# EasyEDA Pro project 3.PCB工程源文件-WCH-DAPLink x RY-CH32V203.epro

# Schematic schematic1
Create Date: 2024-02-26; Page Name: P1; Project Name: wch-daplink V1.0; Schematic Name: schematic1; Update Date: 2024-03-10; Company: 嘉立创EDA; Page Size: A4; Version: V2.0
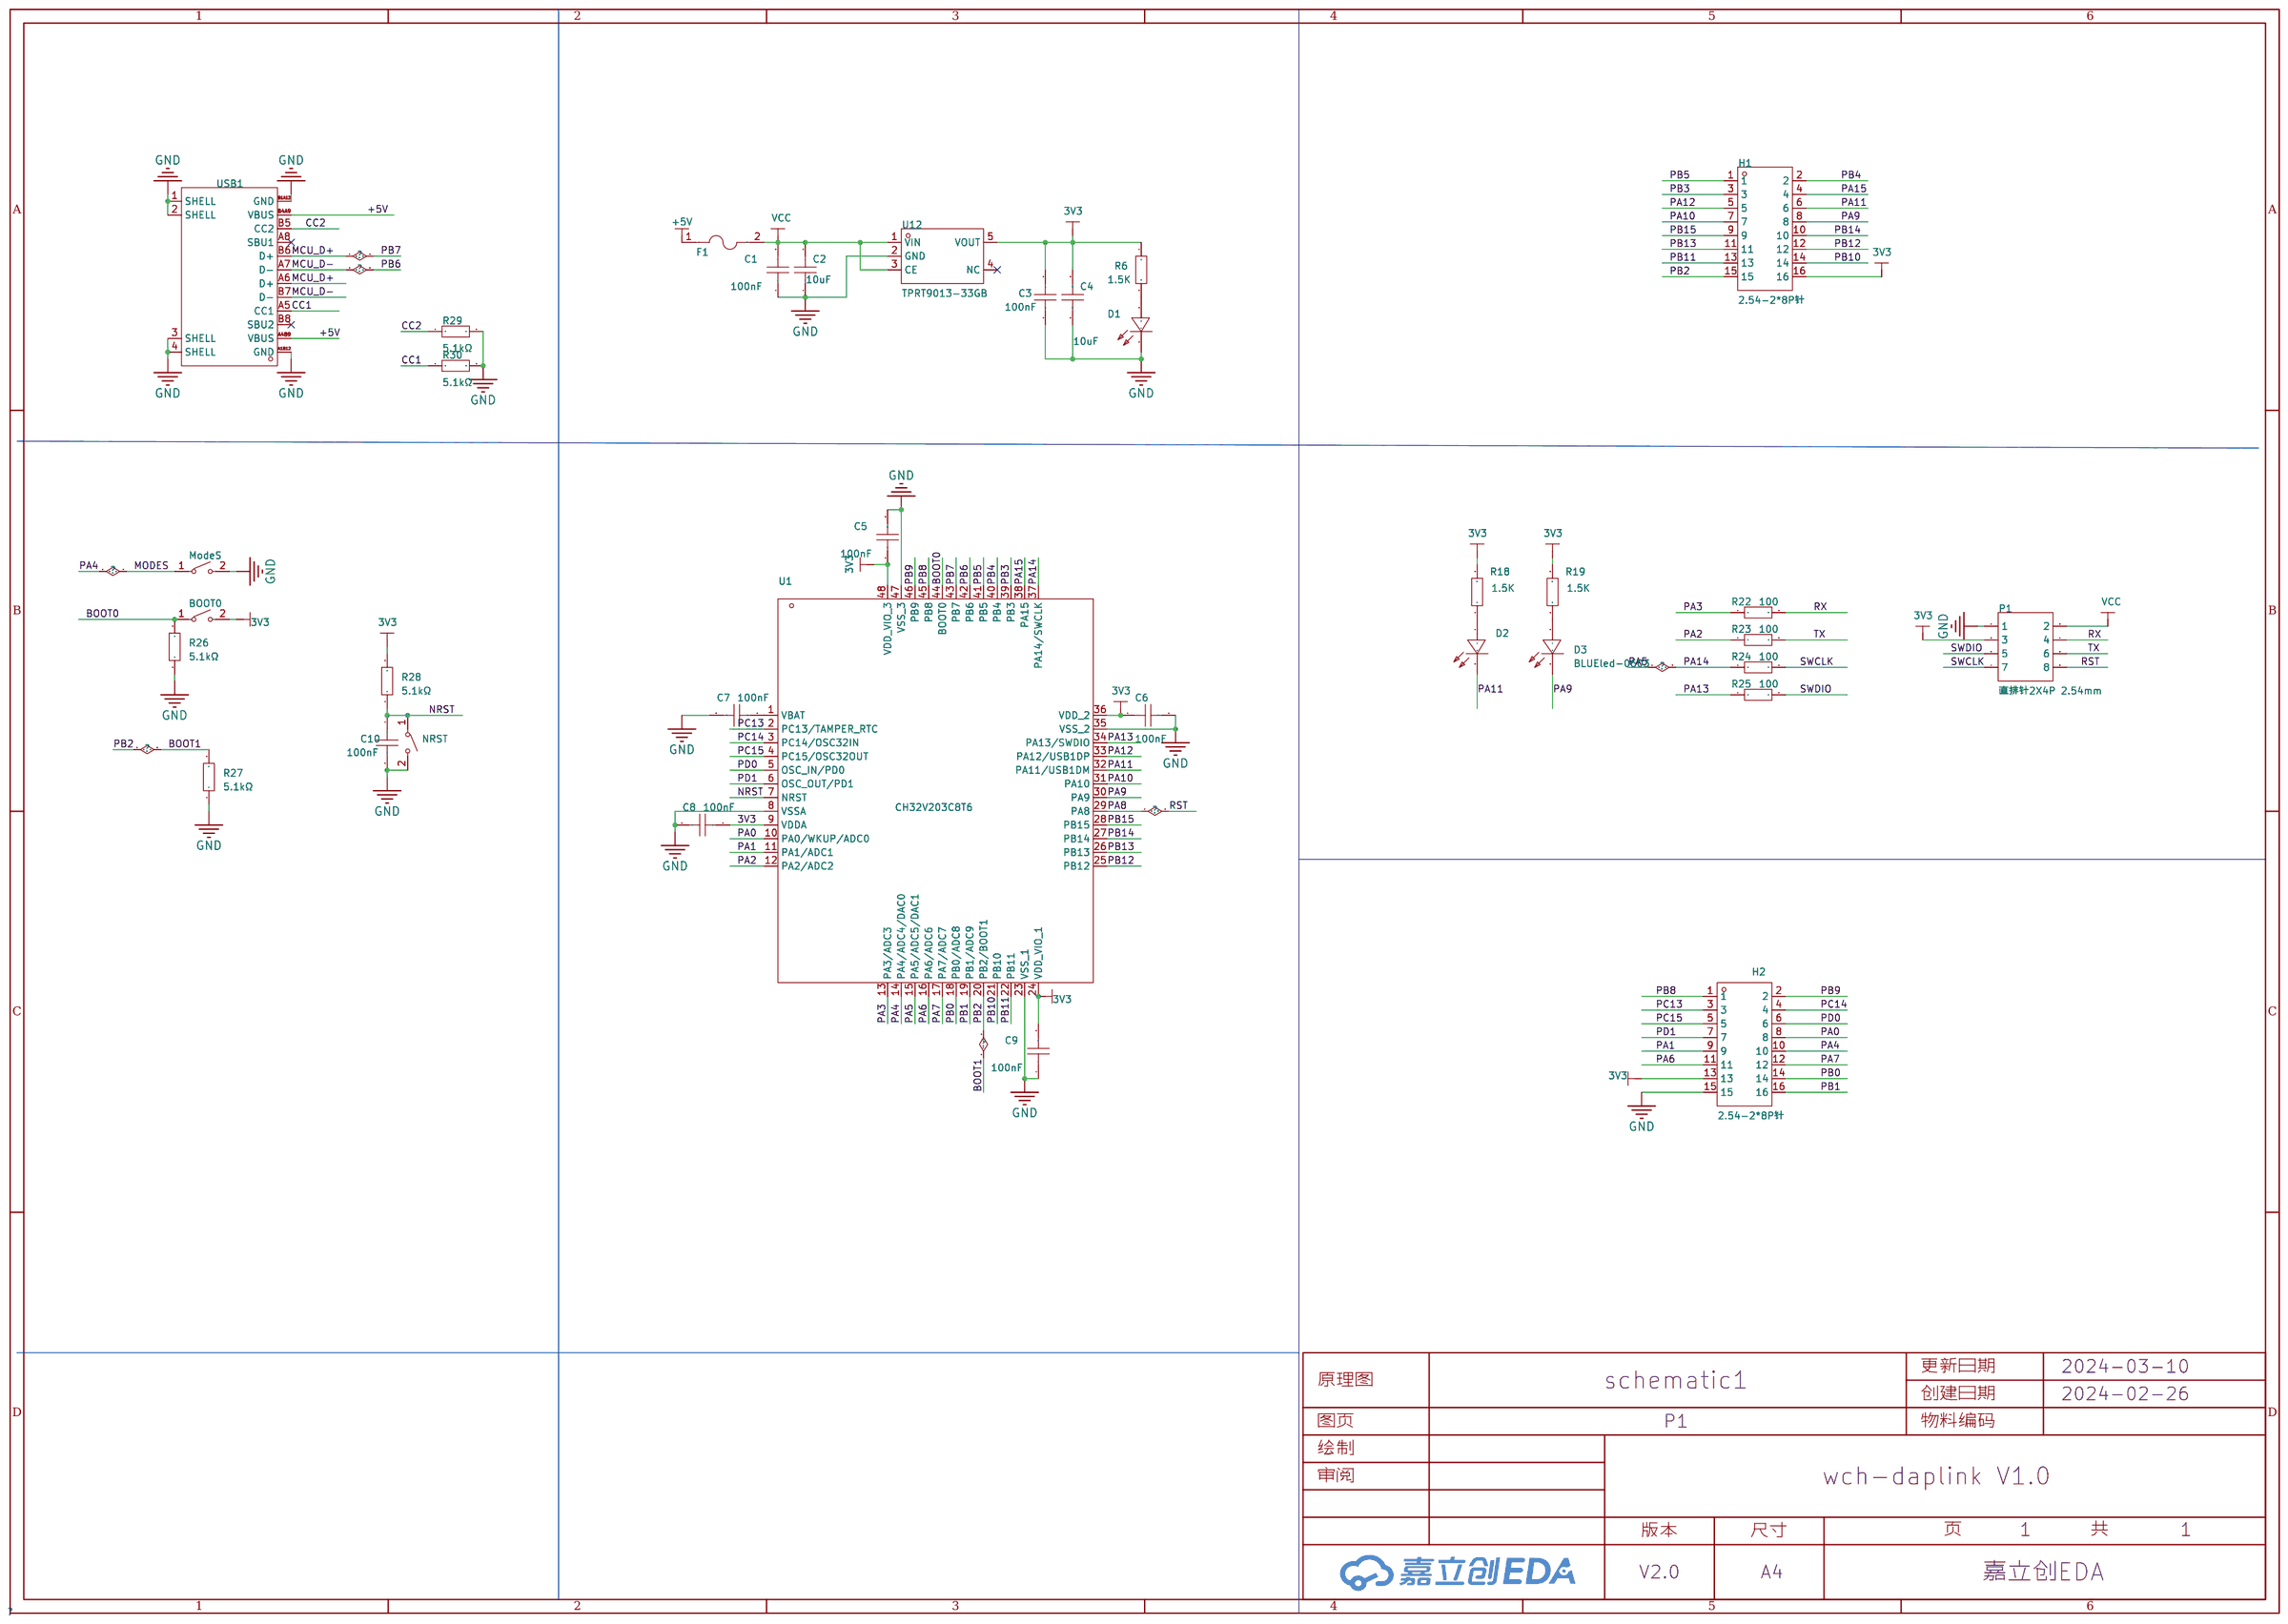
[diagram p0: schematic sheet]

## Parts
BOOT0  TS-1088R-02526  [SW-SMD_L3.9-W3.0-P4.45]
C1  100nF  [c0603]
C2  10uF  [c0805]
C3  100nF  [c0603]
C4  10uF  [c0805]
C5  100nF  [c0603]
C6  100nF  [c0603]
C7  100nF  [c0603]
C8  100nF  [c0603]
C9  100nF  [c0603]
C10  100nF  [c0603]
D1  NCD0603R3  [led0603-r-rd_red]
D2  NCD0603R3  [LED0603-R-RD_RED]
D3  BLUEled-0603  [LED0603-RD_BLUE]
F1  -  [F0805]
H1  2.54-2*8P针  [HDR-TH_16P-P2.54-V-M-R2-C8-S2.54]
H2  2.54-2*8P针  [HDR-TH_16P-P2.54-V-M-R2-C8-S2.54]
ModeS  TS-1088R-02526  [SW-SMD_L3.9-W3.0-P4.45]
NRST  TS-1088R-02526  [SW-SMD_L3.9-W3.0-P4.45]
P1  直排针2X4P 2.54mm  [HDR-TH_8P-P2.54-V-M-R2-C4-S2.54]
R6  1.5K  [R0603]
R18  1.5K  [R0603]
R19  1.5K  [R0603]
R22  100  [R0603]
R23  100  [R0603]
R24  100  [R0603]
R25  100  [R0603]
R26  5.1kΩ  [R0603]
R27  5.1kΩ  [R0603]
R28  5.1kΩ  [R0603]
R29  5.1kΩ  [R0603]
R30  5.1kΩ  [R0603]
U1  CH32V203C8T6  [LQFP-48_L7.0-W7.0-P0.50-LS9.0-BL]
U12  TPRT9013-33GB  [SOT-23-5_L3.0-W1.7-P0.95-LS2.8-BL]
USB1  -  [USB-C-SMD_G-SWITCH_GT-USB-7010EN]

## Library data of the parts
BOOT0 ModeS NRST = TS-1088R-02526: 触点电流:50mA;额定电压(DC):12V;电路结构:单刀单掷;安装方式:立贴;按钮形状:圆形按钮;带灯:-;开关长度:3.9mm;开关宽度:2.93mm;开关高度:2.5mm;; LCSC Part Name: 贴片无柱小龟轻触开关 260GF; Supplier Part: C455281; Manufacturer: XUNPU(讯普); Supplier Footprint: SMD,3x4x2.5mm; JLCPCB Part Class: Extended Part; Datasheet: https://atta.szlcsc.com/upload/public/pdf/source/20191118/C455281_EC5379764BC1462550DF64BBBFEA9579.pdf; Supplier: LCSC; Contact Current: 50mA; Voltage Rating (DC): 12V; Circuit: 单刀单掷; Mounting Style: 立贴; Actuator Style: 圆形按钮; Switch Length: 3.9mm; Switch Width: 2.93mm; Switch Height: 2.5mm
C1 C3 C5-C10 = CC0603KRX7R9BB104: 容值:100nF;精度:±10%;额定电压:50V;材质(温度系数):X7R;; LCSC Part Name: 100nF ±10% 50V; Supplier Part: C14663; Manufacturer: YAGEO(国巨); Supplier Footprint: 0603; JLCPCB Part Class: Basic Part; Datasheet: https://atta.szlcsc.com/upload/public/pdf/source/20170116/1484561234239.pdf; Supplier: LCSC; Tolerance: ±10%; Voltage Rated: 50V; Temperature Coefficient: X7R
C2 C4 = CC0805FRNPO9BN330: 容值:33pF;精度:±1pF;额定电压:50V;材质(温度系数):NP0;; LCSC Part Name: 33pF ±1pF 50V; Supplier Part: C541516; Manufacturer: YAGEO(国巨); Supplier Footprint: 0805; JLCPCB Part Class: Extended Part; Datasheet: https://atta.szlcsc.com/upload/public/pdf/source/20200615/C541516_87B4F5CEA473EFDDBB2B4786DAFFF3AA.pdf; Supplier: LCSC; Tolerance: ±1pF; Voltage Rated: 50V; Temperature Coefficient: NP0
D1 D2 = NCD0603R3: 尺寸1.6x0.8x0.8；IF=20ma：1.6~2.6v，620~640nm,51~150mcd金线，光强高，功耗低，可靠性好，寿命长; LCSC Part Name: 红色;贴片LED;0603红灯;; Supplier Part: C3151730; Manufacturer: 国星光电; Supplier Footprint: 0603; JLCPCB Part Class: Extended Part; Datasheet: https://atta.szlcsc.com/upload/public/pdf/source/20220704/CBFF28C1847A97213A75929E60B7DDE7.pdf; Supplier: LCSC
D3 = BLUEled-0603: Supplier Part: C9900004683; Supplier Footprint: LED0603; JLCPCB Part Class: 扩展库; Supplier: LCSC
F1 = ASMD0805-075: 最大电压:6V;最大电流:40A;保持电流:750mA;跳闸电流:1.5A;消耗功率:600mW;初始态阻值(最小值):90mΩ;跳断后阻值(最大值):385mΩ;最大动作时间:200ms;工作温度:-40~+85;; LCSC Part Name: 0.75A 自恢复; Supplier Part: C135330; Manufacturer: JDTfuse集电通; Supplier Footprint: 0805; JLCPCB Part Class: Extended Part; Datasheet: https://atta.szlcsc.com/upload/public/pdf/source/20171014/C135330_15079756464341038401.pdf; Supplier: LCSC; Operating Voltage (Max): 6V; Current Rating (Max): 40A; Hold Current: 750mA; Trip Current: 1.5A; Power Dissipation: 600mW; Resistance - Initial (Ri) (Min): 90mΩ; Resistance - Post Trip (R1) (Max): 385mΩ; Maximum Time to Trip: 200ms; Operating Temperature: -40~+85
H1 H2 = 2.54-2*8P针_C779499: 圆针/方针:-;额定电流:-;额定电压:-;配合针长度:-;塑高:-;触头材质:-;; LCSC Part Name: 双排直插 2*8排针 2.54mm; Supplier Part: C779499; Manufacturer: BOOMELE(博穆精密); Supplier Footprint: 插件,P=2.54mm; JLCPCB Part Class: 扩展库; Datasheet: https://atta.szlcsc.com/upload/public/pdf/source/20221201/C605E3BE9C0F7226363017EFD1BDE852.pdf; Supplier: LCSC
P1 = 直排针2X4P 2.54mm: 圆针/方针:-;额定电流:-;额定电压:-;配合针长度:-;塑高:-;触头材质:-;; LCSC Part Name: 排针 2*4P 2.54mm; Supplier Part: C58363; Manufacturer: BOOMELE(博穆精密); Supplier Footprint: 插件,P=2.54mm; JLCPCB Part Class: 扩展库; Datasheet: https://atta.szlcsc.com/upload/public/pdf/source/20151026/1457707506726.pdf; Supplier: LCSC
R6 R18 R19 R22-R25 = TR0603B10K0P0525Z: 电阻类型:薄膜电阻;阻值:10kΩ;精度:±0.1%;功率:100mW;温度系数:±25ppm/;最大工作电压:75V;工作温度范围:-55~+155;; LCSC Part Name: 10kΩ ±0.1% 100mW; Supplier Part: C188363; Manufacturer: EVER OHMS(天二科技); Supplier Footprint: 0603; JLCPCB Part Class: Extended Part; Datasheet: https://atta.szlcsc.com/upload/public/pdf/source/20190415/C188363_433BF05B6FB8F7A0F5F35A3E4390C55A.pdf; Supplier: LCSC; Type: 薄膜电阻; Tolerance: ±0.1%; Power(Watts): 100mW; Temperature Coefficient: ±25ppm/; Overload Voltage (Max): 75V; Operating Temperature Range: -55~+155
R26-R30 = 0603WAF5101T5E: 阻值:5.1kΩ;精度:±1%;功率:100mW;温度系数:±100ppm/℃;电阻类型:厚膜电阻;; LCSC Part Name: 5.1kΩ ±1% 100mW 厚膜电阻; Supplier Part: C23186; Manufacturer: UNI-ROYAL(厚声); Supplier Footprint: 0603; JLCPCB Part Class: Basic Part; Datasheet: https://atta.szlcsc.com/upload/public/pdf/source/20200306/C422600_1E6D84923E4A46A82E41ADD87F860B5C.pdf; Supplier: LCSC; Tolerance: ±1%; Power(Watts): 100mW; Overload Voltage (Max): 75V; Temperature Coefficient: ±100ppm/℃; Type: 厚膜电阻; Operating Temperature Range: -55℃~+155℃
U1 = CH32V203C8T6: CPU内核:RISC-V;程序存储容量:64KB;RAM总容量:20KB;GPIO端口数量:-;工作电压范围:-;CPU最大主频:144MHz;程序存储器类型:FLASH;; Supplier Part: C3001172; Manufacturer: WCH(南京沁恒); Supplier Footprint: LQFP-48(7x7); JLCPCB Part Class: 扩展库; Datasheet: https://atta.szlcsc.com/upload/public/pdf/source/20220425/D3E728E801B9982E2758AC225E3A30F9.pdf; Supplier: LCSC; CPU Core: RISC-V; Program Storage Size: 64KB; RAM Size: 20KB; CPU Maximum Speed: 144MHz; Program Memory Type: FLASH
U12 = TPRT9013-33GB: 输出类型:-;; Supplier Part: C587158; Manufacturer: TECH PUBLIC(台舟); Supplier Footprint: SOT-23-5; JLCPCB Part Class: 扩展库; Datasheet: https://atta.szlcsc.com/upload/public/pdf/source/20210810/692D4D0C3CF190F9330EFD28C3E572CB.pdf; Supplier: LCSC
USB1 = HC-TYPE-C-16P-01A-R: 连接器类型:Type-C;公母:母座;触点数量:16;端口数量:1;安装方式:卧贴;; LCSC Part Name: Type-C 母座 卧贴; Supplier Part: C2997433; Manufacturer: HCTL(华灿天禄); Supplier Footprint: SMD; Datasheet: https://atta.szlcsc.com/upload/public/pdf/source/20220415/23B51DCADC5F28223C40C3605487ACA1.pdf; Supplier: LCSC; Connector Type: Type-C; Gender: 母座; Number of Contacts: 16; Number of Ports: 1; Mounting Style: 卧贴

## Nets
3V3: BOOT0.2 C3.1 C4.2 C5.1 C6.1 C8.1 C9.2 H1.16 H2.13 P1.3 R6.1 R18.2 R19.2 R28.2 U1.9(VDDA) U1.24(VDD_VIO_1) U1.36(VDD_2) U1.48(VDD_VIO_3) U12.5(VOUT)
+5V: F1.1 USB1.A4B9(VBUS) USB1.B4A9(VBUS)
GND: C1.1 C2.1 C3.2 C4.1 C5.2 C6.2 C7.2 C8.2 C9.1 C10.2 D1.2(K) H2.15 ModeS.2 NRST.2 P1.1 R26.1 R27.1 R29.2 R30.2 U1.8(VSSA) U1.23(VSS_1) U1.35(VSS_2) U1.47(VSS_3) U12.2(GND) USB1.1(SHELL) USB1.2(SHELL) USB1.3(SHELL) USB1.4(SHELL) USB1.A1B12(GND) USB1.B1A12(GND)
VCC: C1.2 C2.2 F1.2 P1.2 U12.1(VIN) U12.3(CE)
BOOT0: BOOT0.1 R26.2 U1.44(BOOT0)
BOOT1: H1.15 R27.2 U1.20(PB2/BOOT1)
CC1: R30.1 USB1.A5(CC1)
CC2: R29.1 USB1.B5(CC2)
MCU_D+: U1.43(PB7) USB1.A6(D+) USB1.B6(D+)
MCU_D-: U1.42(PB6) USB1.A7(D-) USB1.B7(D-)
MODES: H2.10 ModeS.1 U1.14(PA4/ADC4/DAC0)
NRST: C10.1 NRST.1 R28.1 U1.7(NRST)
PA0: H2.8 U1.10(PA0/WKUP/ADC0)
PA1: H2.9 U1.11(PA1/ADC1)
PA2: R23.1 U1.12(PA2/ADC2)
PA3: R22.1 U1.13(PA3/ADC3)
PA6: H2.11 U1.16(PA6/ADC6)
PA7: H2.12 U1.17(PA7/ADC7)
PA8: P1.8 U1.29(PA8)
PA9: D3.1(K) H1.8 U1.30(PA9)
PA10: H1.7 U1.31(PA10)
PA11: D2.2(K) H1.6 U1.32(PA11/USB1DM)
PA12: H1.5 U1.33(PA12/USB1DP)
PA13: R25.1 U1.34(PA13/SWDIO)
PA14: R24.1 U1.15(PA5/ADC5/DAC1) U1.37(PA14/SWCLK)
PA15: H1.4 U1.38(PA15)
PB0: H2.14 U1.18(PB0/ADC8)
PB1: H2.16 U1.19(PB1/ADC9)
PB3: H1.3 U1.39(PB3)
PB4: H1.2 U1.40(PB4)
PB5: H1.1 U1.41(PB5)
PB8: H2.1 U1.45(PB8)
PB9: H2.2 U1.46(PB9)
PB10: H1.14 U1.21(PB10)
PB11: H1.13 U1.22(PB11)
PB12: H1.12 U1.25(PB12)
PB13: H1.11 U1.26(PB13)
PB14: H1.10 U1.27(PB14)
PB15: H1.9 U1.28(PB15)
PC13: H2.3 U1.2(PC13/TAMPER_RTC)
PC14: H2.4 U1.3(PC14/OSC32IN)
PC15: H2.5 U1.4(PC15/OSC32OUT)
PD0: H2.6 U1.5(OSC_IN/PD0)
PD1: H2.7 U1.6(OSC_OUT/PD1)
RX: P1.4 R22.2
SWCLK: P1.7 R24.2
SWDIO: P1.5 R25.2
TX: P1.6 R23.2
$1N1230: D2.1(A) R18.1
$1N1578: C7.1 U1.1(VBAT)
$1N5862: D1.1(A) R6.2
$1N8246: D3.2(A) R19.1

Not connected (* = marked no-connect by the designer): U12 4(NC)*; USB1 A8(SBU1)* B8(SBU2)*

# Board PCB1_1
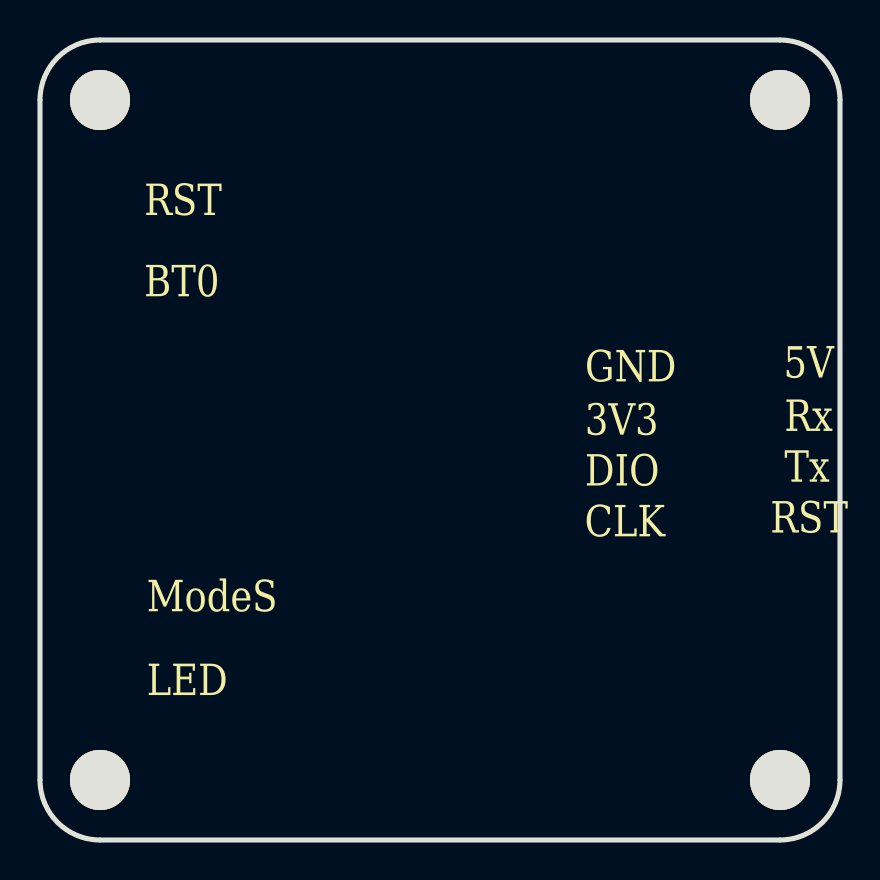
[diagram p1: board, top side]
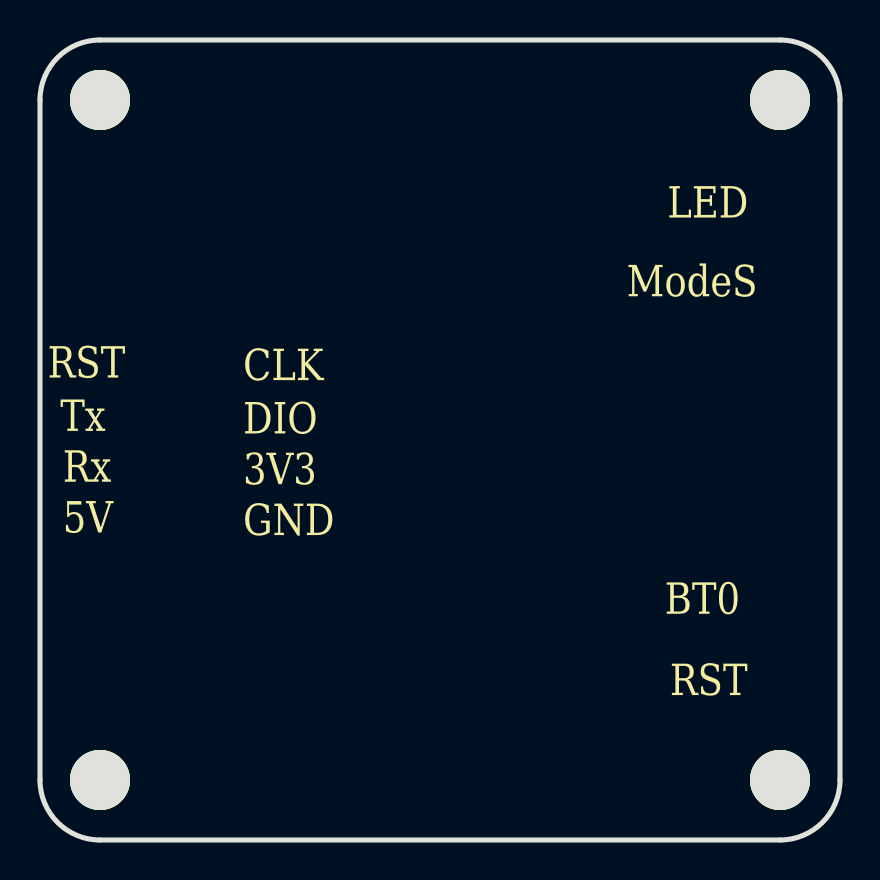
[diagram p2: board, bottom side, seen from below]

Outline 40 x 40 mm; copper layers: Top Layer, Bottom Layer. Coordinates in mm from the lower left corner of the outline.
Outline path: 0,37 arc(0.88,39.12) 3,40 37,40 arc(39.12,39.12) 40,37 40,3 arc(39.12,0.88) 37,0 3,0 arc(0.88,0.88) 0,3 0,37
Stack: Top Layer 0.035mm / Dielectric1 1.51mm FR4 er 4.5 / Bottom Layer 0.035mm

## Design rules (mm)
template: JLCPCB Capability(Two Layers Board)
spacing copperThickness1oz (default): track to track 0.102, other pairs 0.152 to 0.3
spacing copperThickness2oz: track to track 0.203, other pairs 0.152 to 0.3
track width copperThickness1oz (default): min 0.127, default 0.254, max 2.54
track width copperThickness2oz: min 0.203, default 0.254, max 2.54
differential pair differentialPair (default): width min 0.127, default 0.254, max 2.54; gap min 0.152, default 0.152
via viaSize (default): diameter min 0.5, default 0.61, max 10; hole min 0.3, default 0.305, max 6.3

## Placement (name value [footprint] x y rotation side)
NOREF  -  [Pad_e78]  3 3 270 top
NOREF#2  -  [Pad_e79]  37 3 270 top
NOREF#3  -  [Pad_e77]  37 37 270 top
NOREF#4  -  [Pad_e76]  3 37 270 top

## Footprints (pads in the part's own frame, mm; a bottom-side part is the same pattern mirrored in y, then rotated)
Pad_e76
  round 3 hole 3: N(0,0)
Pad_e77
  round 3 hole 3: N(0,0)
Pad_e78
  round 3 hole 3: N(0,0)
Pad_e79
  round 3 hole 3: N(0,0)

## Nets

Pads without a net: NOREF N; NOREF#2 N; NOREF#3 N; NOREF#4 N

## Text on the board
Bottom Silkscreen Layer: RST | LED | BT0 | ModeS | CLK | DIO | 3V3 | GND | Rx | 5V | Tx
Top Silkscreen Layer: RST | BT0 | ModeS | LED | CLK | 3V3 | DIO | GND | 5V | Rx | Tx

# Board PCB1
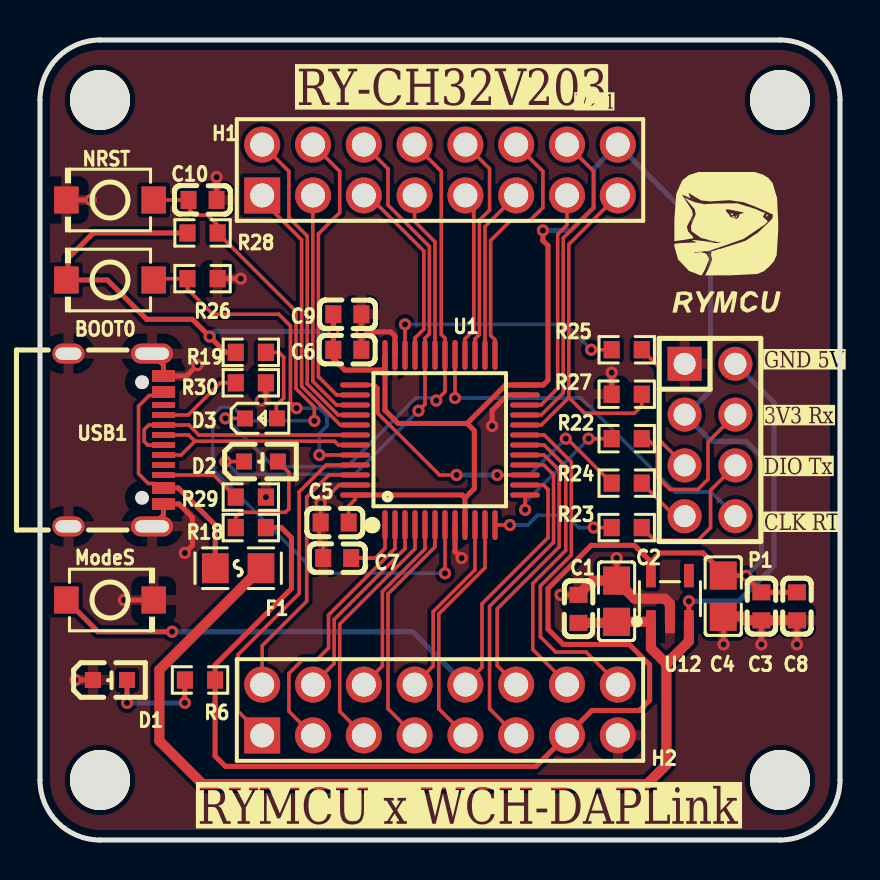
[diagram p3: board, top side]
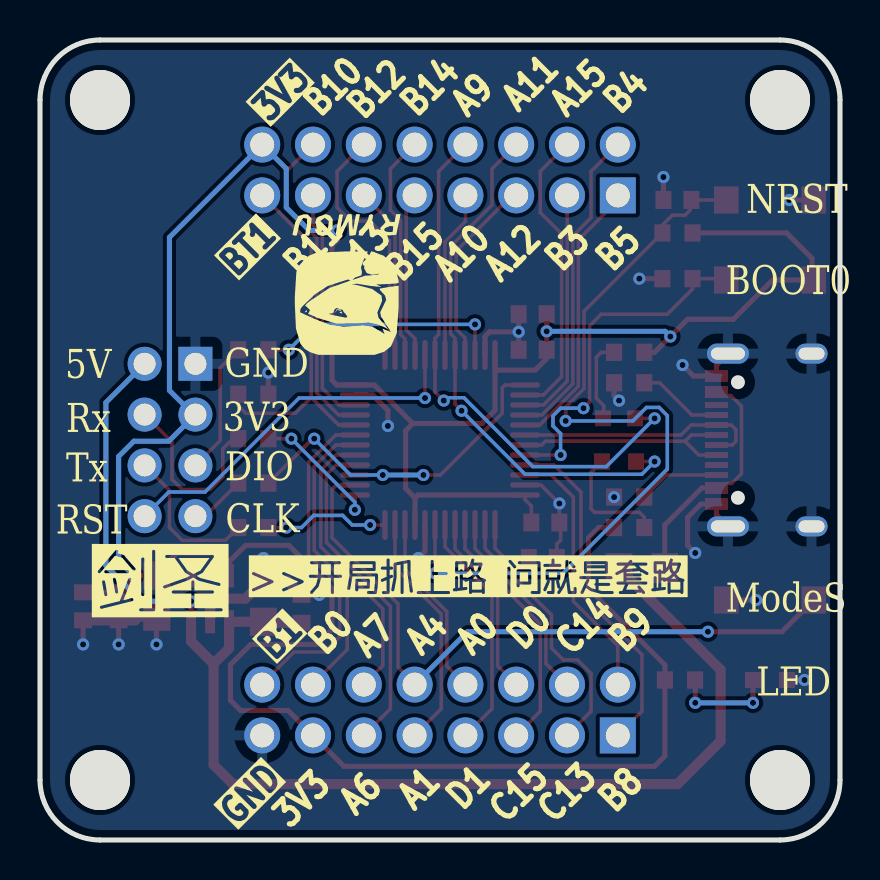
[diagram p4: board, bottom side, seen from below]

Outline 40 x 40 mm; copper layers: Top Layer, Bottom Layer. Coordinates in mm from the lower left corner of the outline.
Outline path: 0,37 arc(0.88,39.12) 3,40 37,40 arc(39.12,39.12) 40,37 40,3 arc(39.12,0.88) 37,0 3,0 arc(0.88,0.88) 0,3 0,37
Stack: Top Layer 0.035mm / Dielectric1 1.51mm FR4 er 4.5 / Bottom Layer 0.035mm

## Design rules (mm)
template: JLCPCB Capability(Two Layers Board)
spacing copperThickness1oz (default): track to track 0.102, other pairs 0.152 to 0.3
spacing copperThickness2oz: track to track 0.203, other pairs 0.152 to 0.3
track width copperThickness1oz (default): min 0.127, default 0.254, max 2.54
track width copperThickness2oz: min 0.203, default 0.254, max 2.54
differential pair differentialPair (default): width min 0.127, default 0.254, max 2.54; gap min 0.152, default 0.152
via viaSize (default): diameter min 0.5, default 0.61, max 10; hole min 0.3, default 0.305, max 6.3

## Placement (name value [footprint] x y rotation side)
BOOT0  TS-1088R-02526  [SW-SMD_L3.9-W3.0-P4.45]  3.5 28 180 top
C1  100nF  [c0603]  26.92 11.56 270 top
C2  10uF  [c0805]  28.83 11.94 270 top
C3  100nF  [c0603]  36.07 11.68 270 top
C4  10uF  [c0805]  34.16 12.19 90 top
C5  100nF  [c0603]  14.73 15.88 180 top
C6  100nF  [c0603]  15.37 24.51 0 top
C7  100nF  [c0603]  14.86 14.1 180 top
C8  100nF  [c0603]  37.85 11.68 270 top
C9  100nF  [c0603]  15.37 26.29 180 top
C10  100nF  [c0603]  8.13 32 0 top
D1  NCD0603R3  [led0603-r-rd_red]  3.5 8 0 top
D2  NCD0603R3  [LED0603-R-RD_RED]  11.05 18.92 0 top
D3  BLUEled-0603  [LED0603-RD_BLUE]  11.05 21.08 0 top
F1  -  [F0805]  9.91 13.59 0 top
H1  2.54-2*8P针  [HDR-TH_16P-P2.54-V-M-R2-C8-S2.54]  20 33.5 0 top
H2  2.54-2*8P针  [HDR-TH_16P-P2.54-V-M-R2-C8-S2.54]  20 6.5 0 top
ModeS  TS-1088R-02526  [SW-SMD_L3.9-W3.0-P4.45]  3.5 12 0 top
NOREF  -  [Pad_e2236]  37 37 270 top
NOREF#2  -  [Pad_e2237]  3 3 270 top
NOREF#3  -  [Pad_e2238]  37 3 270 top
NOREF#4  -  [Pad_e2235]  3 37 270 top
NRST  TS-1088R-02526  [SW-SMD_L3.9-W3.0-P4.45]  3.5 32 180 top
P1  直排针2X4P 2.54mm  [HDR-TH_8P-P2.54-V-M-R2-C4-S2.54]  33.5 20 270 top
R6  1.5K  [R0603]  8 8 180 top
R18  1.5K  [R0603]  10.54 15.62 0 top
R19  1.5K  [R0603]  10.54 24.38 180 top
R22  100  [R0603]  29.34 20.07 0 top
R23  100  [R0603]  29.34 15.62 0 top
R24  100  [R0603]  29.34 17.84 0 top
R25  100  [R0603]  29.34 24.51 0 top
R26  5.1kΩ  [R0603]  8.13 28.07 180 top
R27  5.1kΩ  [R0603]  29.34 22.29 0 top
R28  5.1kΩ  [R0603]  8.13 30.35 180 top
R29  5.1kΩ  [R0603]  10.54 17.14 0 top
R30  5.1kΩ  [R0603]  10.54 22.86 0 top
U1  CH32V203C8T6  [LQFP-48_L7.0-W7.0-P0.50-LS9.0-BL]  20 20 0 top
U12  TPRT9013-33GB  [SOT-23-5_L3.0-W1.7-P0.95-LS2.8-BL]  31.5 12.06 0 top
USB1  -  [USB-C-SMD_G-SWITCH_GT-USB-7010EN]  3.8 20 270 top

## Footprints (pads in the part's own frame, mm; a bottom-side part is the same pattern mirrored in y, then rotated)
c0603
  rect 0.8x0.9 smd: 1(-0.7,0) 2(0.7,0)
c0805
  rect 1.41x1.35 smd: 1(-1.03,0) 2(1.03,0)
F0805
  rect 1.335x1.5 smd: 1(-1.143,0) 2(1.143,0)
HDR-TH_8P-P2.54-V-M-R2-C4-S2.54
  rect 1.7x1.7 hole 1.1: 1(-3.81,-1.27)
  round 1.7 hole 1.1: 2(-3.81,1.27) 3(-1.27,-1.27) 4(-1.27,1.27) 5(1.27,-1.27) 6(1.27,1.27) 7(3.81,-1.27) 8(3.81,1.27)
HDR-TH_16P-P2.54-V-M-R2-C8-S2.54
  rect 1.8x1.8 hole 1.2: 1(-8.89,-1.27)
  round 1.8 hole 1.2: 2(-8.89,1.27) 3(-6.35,-1.27) 4(-6.35,1.27) 5(-3.81,-1.27) 6(-3.81,1.27) 7(-1.27,-1.27) 8(-1.27,1.27) 9(1.27,-1.27) 10(1.27,1.27) 11(3.81,-1.27) 12(3.81,1.27) 13(6.35,-1.27) 14(6.35,1.27) 15(8.89,-1.27) 16(8.89,1.27)
led0603-r-rd_red
  rect 0.8x0.8 smd: 1(0.851,0) 2(-0.851,0)
LED0603-R-RD_RED
  rect 0.8x0.8 smd: 1(0.851,0) 2(-0.851,0)
LED0603-RD_BLUE
  rect 0.8x0.8 smd: 1(-0.799,-0.004) 2(0.799,0.004)
LQFP-48_L7.0-W7.0-P0.50-LS9.0-BL
  oval 0.27x1.5 smd: 1(-2.75,-4.25) 2(-2.25,-4.25) 3(-1.75,-4.25) 4(-1.25,-4.25) 5(-0.75,-4.25) 6(-0.25,-4.25) 7(0.25,-4.25) 8(0.75,-4.25) 9(1.25,-4.25) 10(1.75,-4.25) 11(2.25,-4.25) 12(2.75,-4.25) 25(2.75,4.25) 26(2.25,4.25) 27(1.75,4.25) 28(1.25,4.25) 29(0.75,4.25) 30(0.25,4.25) 31(-0.25,4.25) 32(-0.75,4.25) 33(-1.25,4.25) 34(-1.75,4.25) 35(-2.25,4.25) 36(-2.75,4.25)
  oval 1.5x0.27 smd: 13(4.25,-2.75) 14(4.25,-2.25) 15(4.25,-1.75) 16(4.25,-1.25) 17(4.25,-0.75) 18(4.25,-0.25) 19(4.25,0.25) 20(4.25,0.75) 21(4.25,1.25) 22(4.25,1.75) 23(4.25,2.25) 24(4.25,2.75) 37(-4.25,2.75) 38(-4.25,2.25) 39(-4.25,1.75) 40(-4.25,1.25) 41(-4.25,0.75) 42(-4.25,0.25) 43(-4.25,-0.25) 44(-4.25,-0.75) 45(-4.25,-1.25) 46(-4.25,-1.75) 47(-4.25,-2.25) 48(-4.25,-2.75)
Pad_e2235
  round 3 hole 3: N(0,0)
Pad_e2236
  round 3 hole 3: N(0,0)
Pad_e2237
  round 3 hole 3: N(0,0)
Pad_e2238
  round 3 hole 3: N(0,0)
R0603
  rect 0.806x0.864 smd: 1(-0.753,0) 2(0.753,0)
SOT-23-5_L3.0-W1.7-P0.95-LS2.8-BL
  rect 0.49x1.157 smd: 1(-0.95,-1.153) 2(0,-1.153) 3(0.95,-1.153)
  rect 0.49x1.175 smd: 4(0.95,1.153) 5(-0.95,1.153)
SW-SMD_L3.9-W3.0-P4.45
  rect 1.23x1.36 smd: 1(-2.185,0) 2(2.185,0)
USB-C-SMD_G-SWITCH_GT-USB-7010EN
  oval 1x2.1 hole 0.6x1.7: 1(-4.32,1.802) 2(4.32,1.802)
  oval 1x1.6 hole 0.6x1.3: 3(4.32,-2.377) 4(-4.32,-2.377)
  rect 0.6x1.15 smd: A1B12(-3.2,2.377) A4B9(-2.4,2.377) B1A12(3.2,2.377) B4A9(2.4,2.377)
  rect 0.3x1.15 smd: A5(-1.25,2.377) A6(-0.25,2.377) A7(0.25,2.377) A8(1.25,2.377) B5(1.75,2.377) B6(0.75,2.377) B7(-0.75,2.377) B8(-1.75,2.377)

## Nets
As in the schematic.

Pads without a net: NOREF N; NOREF#2 N; NOREF#3 N; NOREF#4 N; U12 4; USB1 A8 B8

## Via types
v1: diameter 0.61, hole 0.305, Top Layer to Bottom Layer, 45 vias

## Routing (per net, layer and track width the routed paths; a pad name or vN(x,y) marks a point on that pad's centre or on a via; arc(x,y) is an arc through that point)
3V3: length 157.1
  Top Layer w0.178: U1.48 15.75,17.02 15.43,16.7 C5.1
  Top Layer w0.254: 17.25,23.48 17.23,23.49 15.24,23.49 14.67,24.07 C6.1 v1(14.67,25.43) C9.2 ; 17.25,23.48 17.25,21.48 17.91,20.83 21.36,20.83 ; 17.25,23.48 U1.36 ; R28.2 2.67,30.35 1.4,29.08 1.4,28.08 BOOT0.2 3.37,28 5.33,26.03 7.62,26.03 v1(8.48,25.17) 9.27,24.38 R19.2 ; U1.9 21.25,17.1 ; 21.25,17.1 21.1,17.25 U1.48 ; 21.25,17.1 21.72,17.57 21.72,20.47 21.36,20.83 ; R18.2 12.06,15.62 12.57,15.11 12.57,12.57 8.75,8.75 R6.1 8.75,4.2 9.27,3.68 24.8,3.68 27.6,6.48 29.97,6.48 30.48,6.98 30.48,8.76 29.46,9.78 26.16,9.78 25.4,10.54 25.4,12.57 27.56,14.73 29.72,14.73 30.55,13.91 ; 21.36,20.83 23.28,22.75 U1.24 25.16,22.75 25.4,22.99 25.4,29.72 25.15,29.97 v1(25.15,30.48) ; C8.1 C3.1 35.23,13.22 C4.2 34.16,13.33 33.15,14.35 30.99,14.35 30.55,13.91 ; U12.5 30.55,13.91
  Bottom Layer w0.254: v1(35.31,13.21) 36.07,13.97 36.07,19.18 35.31,19.94 33.56,19.94 P1.3 32.32,21.27 33.53,22.48 33.53,30.13 H1.16 27.69,33.57 27.69,31.62 26.54,30.48 v1(25.15,30.48) ; v1(14.67,25.43) 8.74,25.43 v1(8.48,25.17)
+5V: length 12
  Top Layer w0.178: USB1.B4A9 5.93,17.6 5.7,17.82 5.42,17.82 4.93,18.31 4.93,21.69 5.46,22.22 6,22.22 USB1.A4B9
  Top Layer w0.254: F1.1 8.76,15.75 6.91,17.6 USB1.B4A9
GND: length 46
  Top Layer w0.178: U1.47 14.96,17.75 v1(14.03,16.83) C5.2 13.97,15.81 13.97,14.99 14.16,14.8 C7.2
  Top Layer w0.254: ModeS.2 v1(4.19,12) ; C9.1 v1(16.07,25.41) ; v1(16.07,25.41) 17.53,25.41 17.75,25.18 U1.35 ; v1(16.07,25.41) C6.2 ; USB1.1 6.18,23.74 USB1.A1B12 7.32,23.2 v1(7.87,23.75) ; U1.23 23.37,22.25 22.61,21.48 v1(22.61,20.7) ; C8.2 v1(37.85,9.78) ; C3.2 v1(36.07,9.78) ; D1.2 v1(1.78,8) ; U1.8 20.75,14.43 v1(21.08,14.1) ; C1.1 v1(26.03,12.26) ; 34.18,11.18 v1(34.18,9.78) ; v1(11.05,21.97) 11.29,22.22 R30.2 ; R26.1 v1(10.03,28.07) ; NRST.2 v1(2.54,32) ; v1(7.24,14.35) 7.62,14.73 7.62,16.13 6.95,16.8 USB1.B1A12 6.18,16.25 USB1.2 ; R27.1 v1(28.58,23.37) ; C10.2 v1(8.83,33.15) ; v1(28.83,14.1) C2.1
  Top Layer w0.508: C4.1 34.18,11.18 35.05,11.18 35.24,10.98 C3.2 C8.2 ; C1.1 27.63,12.97 C2.1 29.73,12.06 31.24,12.06 31.5,11.81 U12.2
  vias: v1(11.29,17.14)
VCC: length 68
  Top Layer w0.254: U12.3 v1(32.45,11.94)
  Top Layer w0.508: C1.2 28.78,10.86 28.83,10.91 U12.1 30.55,9.59 31.32,8.81 ; U12.3 32.45,9.94 31.32,8.81 ; 31.32,8.81 31.32,3.76 30.35,2.79 8.13,2.79 5.97,4.95 5.97,8.51 F1.2
  Bottom Layer w0.254: 34.77,23.81 36.7,21.88 36.7,13.72 34.92,11.94 v1(32.45,11.94)
BOOT0: length 18
  Top Layer w0.178: v1(12.83,21.59) 12.52,21.9 12.52,25.71 11.94,26.29 8.64,26.29 7.37,27.55 R26.2 5.75,28.07 BOOT0.1 ; U1.44 v1(13.97,19.25)
  Bottom Layer w0.178: v1(13.97,19.25) 13.97,20.32 14.35,20.7 14.35,21.21 13.97,21.59 v1(12.83,21.59)
BOOT1: length 18.6
  Top Layer w0.178: U1.20 25.07,20.75 26.44,22.12 ; R27.2 30.09,21.71 29.72,21.34 27.23,21.34 26.44,22.12 ; 26.44,22.12 26.44,29.78 28.89,32.23
CC1: length 4.3
  Top Layer w0.178: USB1.A5 7.41,21.25 9.02,22.86 R30.1
CC2: length 4.1
  Top Layer w0.178: R29.1 8.68,18.25 USB1.B5
MCU_D+: length 11.6
  Top Layer w0.178: USB1.A6 7.44,20.25 7.75,19.94 ; U1.43 14.92,19.75 14.73,19.94 7.75,19.94 ; 7.75,19.94 7.06,19.25 USB1.B6
MCU_D-: length 12.5
  Top Layer w0.178: USB1.A7 5.38,19.75 5.21,19.93 5.21,20.52 5.44,20.75 USB1.B7 7.44,20.75 7.94,20.25 U1.42
MODES: length 33.8
  Top Layer w0.178: 21.67,8.2 22.1,8.64 22.1,11.81 25.4,15.11 25.4,17.53 25.18,17.75 U1.14
  Top Layer w0.254: ModeS.1 2.9,10.41 v1(6.6,10.41)
  Bottom Layer w0.254: v1(6.6,10.41) 18.63,10.41 H2.10
NRST: length 40.2
  Top Layer w0.178: NRST.1 7.42,32 ; 7.42,32 C10.1 ; 7.42,32 7.49,31.93 7.49,31.5 7.75,31.24 8.38,31.24 8.88,30.74 R28.1 12.8,26.43 12.8,22.57 13.72,21.65 v1(13.72,20.95) ; U1.7 v1(20.25,13.33)
  Bottom Layer w0.178: v1(20.25,13.33) 13.84,13.33 8.64,18.54 8.64,21.22 9.04,21.63 9.68,21.63 10.35,20.95 v1(13.72,20.95)
PA0: length 9.2
  Top Layer w0.178: U1.10 21.75,13.51 19.66,11.42 19.66,8.7 H2.8
PA1: length 12
  Top Layer w0.178: 21.27,5.23 19.94,6.56 19.94,11.3 22.25,13.61 U1.11
PA2: length 6.3
  Top Layer w0.178: U1.12 v1(23.49,15.75) ; R23.1 v1(27.69,15.62)
  Bottom Layer w0.178: v1(27.69,15.62) 26.92,15.62 26.31,16.23 24.87,16.23 24.39,15.75 v1(23.49,15.75)
PA3: length 6.8
  Top Layer w0.178: v1(27.43,20.07) R22.1 ; v1(24.26,16.51) 24.26,17.24 U1.13
  Bottom Layer w0.178: v1(24.26,16.51) 24.26,16.89 v1(27.43,20.07)
PA6: length 16.5
  Top Layer w0.178: U1.16 25.19,18.75 25.68,18.26 25.68,14.88 22.48,11.68 22.48,6.56 23.81,5.23
PA7: length 14.4
  Top Layer w0.178: H2.12 22.86,8.72 22.86,11.56 25.96,14.66 25.96,18.49 25.2,19.25 U1.17
PA8: length 18.6
  Top Layer w0.178: U1.29 v1(20.75,22.1)
  Bottom Layer w0.178: v1(20.75,22.1) 27.05,22.1 31.75,17.4 33.56,17.4 P1.8
PA9: length 27.6
  Top Layer w0.178: H1.8 20.07,33.43 20.07,25.27 20.25,25.09 U1.30 20.25,22.41 v1(19.81,21.97) ; 10.2,21.08 v1(9.27,21.08)
  Bottom Layer w0.178: v1(9.27,21.08) 11.68,18.67 15.36,18.67 18.8,22.11 19.67,22.11 v1(19.81,21.97)
PA10: length 8.4
  Top Layer w0.178: U1.31 19.75,29.91 18.73,30.93 18.73,32.23
PA11: length 27
  Top Layer w0.178: v1(18.92,21.46) 19.25,21.79 U1.32 19.25,25.09 19.47,25.31 19.47,29.68 17.4,31.75 17.4,33.56 H1.6 ; D2.2 v1(9.27,18.92)
  Bottom Layer w0.178: v1(18.92,21.46) 15.75,18.29 9.91,18.29 v1(9.27,18.92)
PA12: length 9.5
  Top Layer w0.178: U1.33 18.75,25.1 19.19,25.54 19.19,29.45 16.41,32.23 16.19,32.23
PA13: length 12.4
  Top Layer w0.178: R25.1 v1(27.56,24.51) ; U1.34 v1(18.25,25.78)
  Bottom Layer w0.178: v1(27.56,24.51) 26.29,25.78 v1(18.25,25.78)
PA14: length 18.5
  Top Layer w0.178: v1(22.86,18.25) U1.15 ; U1.37 16.75,22.75 16.89,22.61 16.89,21.34 19.98,18.25 v1(20.83,18.25) ; v1(26.29,20.07) 26.36,20.07 R24.1
  Bottom Layer w0.178: v1(22.86,18.25) 24.47,18.25 v1(26.29,20.07)
  Bottom Layer w0.254: v1(22.86,18.25) v1(20.83,18.25)
PA15: length 14.8
  Top Layer w0.178: U1.38 14.83,22.25 13.92,23.16 13.92,30.3 14.99,31.37 14.99,33.43 H1.4
PB0: length 14.7
  Top Layer w0.178: 26.35,7.81 24.64,9.52 24.64,12.83 26.29,14.48 26.29,18.67 25.21,19.75 U1.18
PB1: length 17.1
  Top Layer w0.178: U1.19 25.22,20.25 26.57,18.9 26.57,14.25 25.02,12.7 25.02,10.16 25.78,9.4 27.3,9.4 28.89,7.81 H2.16
PB3: length 11.9
  Top Layer w0.178: U1.39 14.83,21.75 13.64,22.94 13.64,32.22 13.65,32.23
PB4: length 15.9
  Top Layer w0.178: U1.40 14.91,21.25 13.36,22.8 13.36,30.2 12.45,31.11 12.45,33.43 H1.2
PB5: length 13.8
  Top Layer w0.178: 11.11,32.23 11.11,31.98 13.08,30.01 13.08,22.68 15.02,20.75 U1.41
PB8: length 17.3
  Top Layer w0.178: U1.45 14.3,18.75 12.95,17.4 12.95,12.32 9.91,9.27 9.91,6.43 11.11,5.23
PB9: length 13.2
  Top Layer w0.178: U1.46 14.44,18.25 13.33,17.14 13.33,11.94 11.11,9.71 H2.2
PB10: length 16
  Top Layer w0.178: U1.21 25.06,21.25 26.16,22.35 26.16,30.1 27.69,31.62 27.69,33.43 H1.14
PB11: length 11.8
  Top Layer w0.178: U1.22 25.05,21.75 25.88,22.58 25.88,30.28 26.35,30.75 26.35,32.23
PB12: length 12.8
  Top Layer w0.178: H1.12 25.15,33.43 25.15,31.62 24.47,30.95 23.51,30.95 22.53,29.97 22.53,25.22 22.75,25 U1.25
PB13: length 8.6
  Top Layer w0.178: 23.81,32.23 22.25,30.67 U1.26
PB14: length 11.3
  Top Layer w0.178: U1.27 21.75,25.05 21.97,25.27 21.97,30.99 22.48,31.5 22.48,33.56 H1.10
PB15: length 8.3
  Top Layer w0.178: U1.28 21.25,25.06 21.69,25.5 21.69,31.81 21.27,32.23
PC13: length 13.6
  Top Layer w0.178: 13.65,5.23 12.45,6.43 12.45,8.33 13.12,9 13.83,9 14.43,9.6 14.43,11.25 17.75,14.57 U1.2
PC14: length 9.9
  Top Layer w0.178: H2.4 14.71,8.83 14.71,11.02 18.25,14.57 U1.3
PC15: length 12.6
  Top Layer w0.178: U1.4 18.75,14.56 14.99,10.8 14.99,6.43 16.19,5.23
PD0: length 9.2
  Top Layer w0.178: H2.6 17.12,8.7 17.12,12.42 19.25,14.55 U1.5
PD1: length 12
  Top Layer w0.178: 18.73,5.23 17.4,6.56 17.4,12.3 19.75,14.66 U1.6
RX: length 9.2
  Top Layer w0.178: P1.4 33.4,19.9 33.4,18.03 32.89,17.53 31.5,17.53 30.86,18.16 30.86,19.56 30.35,20.07 R22.2
SWCLK: length 2.8
  Top Layer w0.178: R24.2 31.74,16.19 P1.7
SWDIO: length 6.7
  Top Layer w0.178: R25.2 30.99,23.61 30.99,19.97 32.23,18.73
TX: length 7.6
  Top Layer w0.178: 34.77,18.73 33.53,17.49 33.53,15.62 32.89,14.99 30.73,14.99 R23.2
$1N1230: length 5.9
  Top Layer w0.178: R18.1 9.79,16.14 10.03,16.38 12.27,16.38 12.45,16.56 12.45,18.38 D2.1
$1N1578: length 3.1
  Top Layer w0.178: U1.1 17.25,14.58 16.76,14.1 15.56,14.1
$1N5862: length 5.2
  Top Layer w0.254: v1(7.24,6.86) 7.24,7.99 R6.2 ; D1.1 v1(4.35,6.86)
  Bottom Layer w0.254: v1(7.24,6.86) v1(4.35,6.86)
$1N8246: length 4.1
  Top Layer w0.178: R19.1 11.94,24.38 12.18,24.14 12.18,22.09 11.81,21.72 11.81,21.3 11.9,21.21

## Copper pours and planes (outline as drawn; the poured copper is in the pictures)
GND on Top Layer: -0.21,40 39.75,40 39.75,0 -0.21,0
GND on Bottom Layer: -0.21,40 39.75,40 39.75,0 -0.21,0

## Text on the board
Bottom Silkscreen Layer: B9 | B4 | B8 | B5 | C14 | A15 | B3 | C13 | D0 | A11 | C15 | A12 | A0 | A9 | D1 | A10 | A4 | B14 | A1 | B15 | A7 | B12 | A6 | B13 | B0 | B10 | B11 | 3V3 | B1 | BT1 | GND | LED | NRST | BOOT0 | ModeS | CLK | DIO | Rx | Tx | 5V | RST | 剑圣 | >>开局抓上路 问就是套路
Top Silkscreen Layer: V2.1 | GND 5V | 3V3 Rx | DIO Tx | CLK RT | RYMCU x WCH-DAPLink | RY-CH32V203

# Board PCB1_2
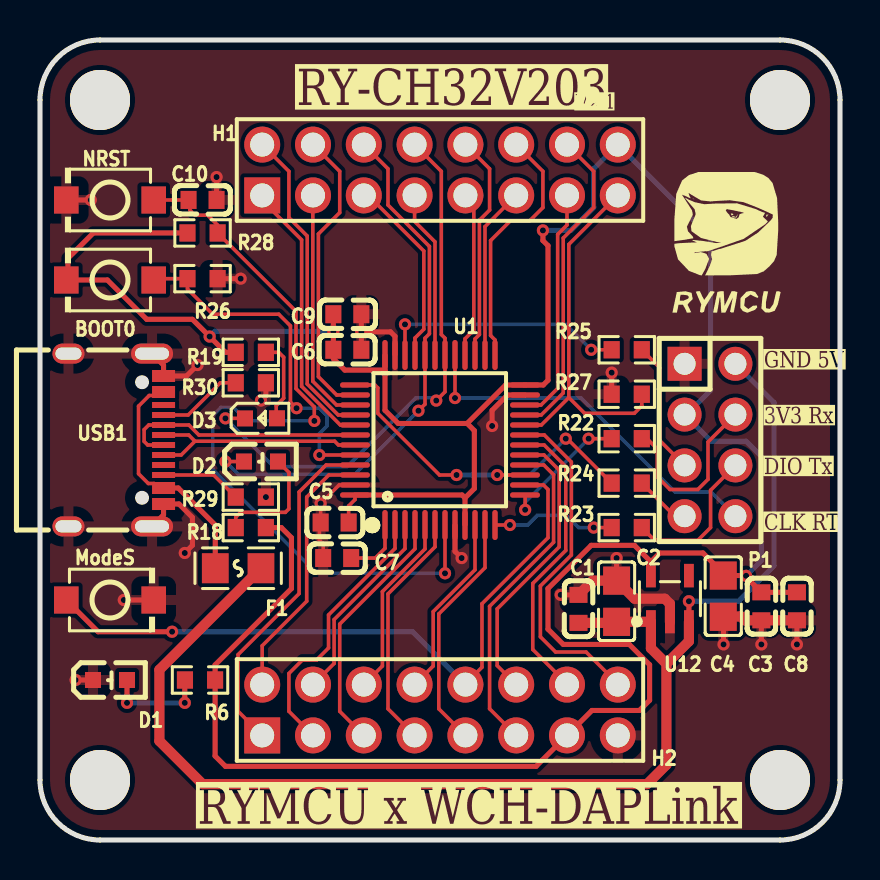
[diagram p5: board, top side]
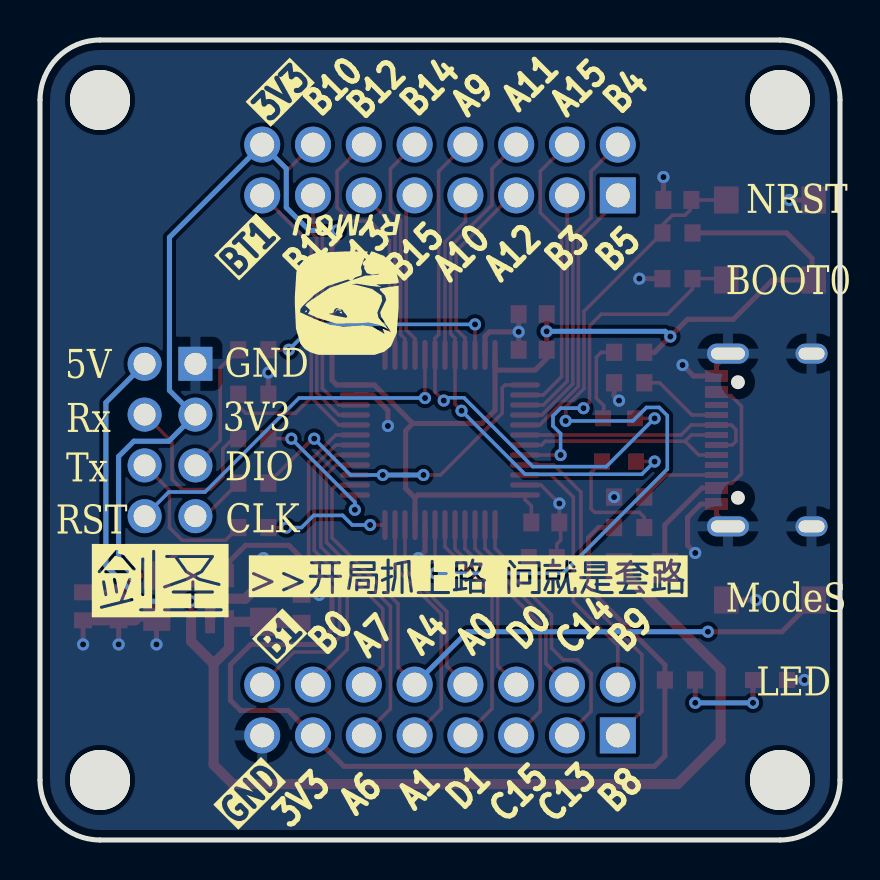
[diagram p6: board, bottom side, seen from below]

Outline 40 x 40 mm; copper layers: Top Layer, Bottom Layer. Coordinates in mm from the lower left corner of the outline.
Outline path: 0,37 arc(0.88,39.12) 3,40 37,40 arc(39.12,39.12) 40,37 40,3 arc(39.12,0.88) 37,0 3,0 arc(0.88,0.88) 0,3 0,37
Stack: Top Layer 0.035mm / Dielectric1 1.51mm FR4 er 4.5 / Bottom Layer 0.035mm

## Design rules (mm)
template: JLCPCB Capability(Two Layers Board)
spacing copperThickness1oz (default): track to track 0.102, other pairs 0.152 to 0.3
spacing copperThickness2oz: track to track 0.203, other pairs 0.152 to 0.3
track width copperThickness1oz (default): min 0.127, default 0.254, max 2.54
track width copperThickness2oz: min 0.203, default 0.254, max 2.54
differential pair differentialPair (default): width min 0.127, default 0.254, max 2.54; gap min 0.152, default 0.152
via viaSize (default): diameter min 0.5, default 0.61, max 10; hole min 0.3, default 0.305, max 6.3

## Placement (name value [footprint] x y rotation side)
BOOT0  TS-1088R-02526  [SW-SMD_L3.9-W3.0-P4.45]  3.5 28 180 top
C1  100nF  [c0603]  26.92 11.56 270 top
C2  10uF  [c0805]  28.83 11.94 270 top
C3  100nF  [c0603]  36.07 11.68 270 top
C4  10uF  [c0805]  34.16 12.19 90 top
C5  100nF  [c0603]  14.73 15.88 180 top
C6  100nF  [c0603]  15.37 24.51 0 top
C7  100nF  [c0603]  14.86 14.1 180 top
C8  100nF  [c0603]  37.85 11.68 270 top
C9  100nF  [c0603]  15.37 26.29 180 top
C10  100nF  [c0603]  8.13 32 0 top
D1  NCD0603R3  [led0603-r-rd_red]  3.5 8 0 top
D2  NCD0603R3  [LED0603-R-RD_RED]  11.05 18.92 0 top
D3  BLUEled-0603  [LED0603-RD_BLUE]  11.05 21.08 0 top
F1  -  [F0805]  9.91 13.59 0 top
H1  2.54-2*8P针  [HDR-TH_16P-P2.54-V-M-R2-C8-S2.54]  20 33.5 0 top
H2  2.54-2*8P针  [HDR-TH_16P-P2.54-V-M-R2-C8-S2.54]  20 6.5 0 top
ModeS  TS-1088R-02526  [SW-SMD_L3.9-W3.0-P4.45]  3.5 12 0 top
NOREF  -  [Pad_e2237]  3 3 270 top
NOREF#2  -  [Pad_e2238]  37 3 270 top
NOREF#3  -  [Pad_e2235]  3 37 270 top
NOREF#4  -  [Pad_e2236]  37 37 270 top
NRST  TS-1088R-02526  [SW-SMD_L3.9-W3.0-P4.45]  3.5 32 180 top
P1  直排针2X4P 2.54mm  [HDR-TH_8P-P2.54-V-M-R2-C4-S2.54]  33.5 20 270 top
R6  1.5K  [R0603]  8 8 180 top
R18  1.5K  [R0603]  10.54 15.62 0 top
R19  1.5K  [R0603]  10.54 24.38 180 top
R22  100  [R0603]  29.34 20.07 0 top
R23  100  [R0603]  29.34 15.62 0 top
R24  100  [R0603]  29.34 17.84 0 top
R25  100  [R0603]  29.34 24.51 0 top
R26  5.1kΩ  [R0603]  8.13 28.07 180 top
R27  5.1kΩ  [R0603]  29.34 22.29 0 top
R28  5.1kΩ  [R0603]  8.13 30.35 180 top
R29  5.1kΩ  [R0603]  10.54 17.14 0 top
R30  5.1kΩ  [R0603]  10.54 22.86 0 top
U1  CH32V203C8T6  [LQFP-48_L7.0-W7.0-P0.50-LS9.0-BL]  20 20 0 top
U12  TPRT9013-33GB  [SOT-23-5_L3.0-W1.7-P0.95-LS2.8-BL]  31.5 12.06 0 top
USB1  -  [USB-C-SMD_G-SWITCH_GT-USB-7010EN]  3.8 20 270 top

## Footprints (pads in the part's own frame, mm; a bottom-side part is the same pattern mirrored in y, then rotated)
c0603
  rect 0.8x0.9 smd: 1(-0.7,0) 2(0.7,0)
c0805
  rect 1.41x1.35 smd: 1(-1.03,0) 2(1.03,0)
F0805
  rect 1.335x1.5 smd: 1(-1.143,0) 2(1.143,0)
HDR-TH_8P-P2.54-V-M-R2-C4-S2.54
  rect 1.7x1.7 hole 1.1: 1(-3.81,-1.27)
  round 1.7 hole 1.1: 2(-3.81,1.27) 3(-1.27,-1.27) 4(-1.27,1.27) 5(1.27,-1.27) 6(1.27,1.27) 7(3.81,-1.27) 8(3.81,1.27)
HDR-TH_16P-P2.54-V-M-R2-C8-S2.54
  rect 1.8x1.8 hole 1.2: 1(-8.89,-1.27)
  round 1.8 hole 1.2: 2(-8.89,1.27) 3(-6.35,-1.27) 4(-6.35,1.27) 5(-3.81,-1.27) 6(-3.81,1.27) 7(-1.27,-1.27) 8(-1.27,1.27) 9(1.27,-1.27) 10(1.27,1.27) 11(3.81,-1.27) 12(3.81,1.27) 13(6.35,-1.27) 14(6.35,1.27) 15(8.89,-1.27) 16(8.89,1.27)
LED0603-R-RD_RED
  rect 0.8x0.8 smd: 1(0.851,0) 2(-0.851,0)
led0603-r-rd_red
  rect 0.8x0.8 smd: 1(0.851,0) 2(-0.851,0)
LED0603-RD_BLUE
  rect 0.8x0.8 smd: 1(-0.799,-0.004) 2(0.799,0.004)
LQFP-48_L7.0-W7.0-P0.50-LS9.0-BL
  oval 0.27x1.5 smd: 1(-2.75,-4.25) 2(-2.25,-4.25) 3(-1.75,-4.25) 4(-1.25,-4.25) 5(-0.75,-4.25) 6(-0.25,-4.25) 7(0.25,-4.25) 8(0.75,-4.25) 9(1.25,-4.25) 10(1.75,-4.25) 11(2.25,-4.25) 12(2.75,-4.25) 25(2.75,4.25) 26(2.25,4.25) 27(1.75,4.25) 28(1.25,4.25) 29(0.75,4.25) 30(0.25,4.25) 31(-0.25,4.25) 32(-0.75,4.25) 33(-1.25,4.25) 34(-1.75,4.25) 35(-2.25,4.25) 36(-2.75,4.25)
  oval 1.5x0.27 smd: 13(4.25,-2.75) 14(4.25,-2.25) 15(4.25,-1.75) 16(4.25,-1.25) 17(4.25,-0.75) 18(4.25,-0.25) 19(4.25,0.25) 20(4.25,0.75) 21(4.25,1.25) 22(4.25,1.75) 23(4.25,2.25) 24(4.25,2.75) 37(-4.25,2.75) 38(-4.25,2.25) 39(-4.25,1.75) 40(-4.25,1.25) 41(-4.25,0.75) 42(-4.25,0.25) 43(-4.25,-0.25) 44(-4.25,-0.75) 45(-4.25,-1.25) 46(-4.25,-1.75) 47(-4.25,-2.25) 48(-4.25,-2.75)
Pad_e2235
  round 3 hole 3: N(0,0)
Pad_e2236
  round 3 hole 3: N(0,0)
Pad_e2237
  round 3 hole 3: N(0,0)
Pad_e2238
  round 3 hole 3: N(0,0)
R0603
  rect 0.806x0.864 smd: 1(-0.753,0) 2(0.753,0)
SOT-23-5_L3.0-W1.7-P0.95-LS2.8-BL
  rect 0.49x1.157 smd: 1(-0.95,-1.153) 2(0,-1.153) 3(0.95,-1.153)
  rect 0.49x1.175 smd: 4(0.95,1.153) 5(-0.95,1.153)
SW-SMD_L3.9-W3.0-P4.45
  rect 1.23x1.36 smd: 1(-2.185,0) 2(2.185,0)
USB-C-SMD_G-SWITCH_GT-USB-7010EN
  oval 1x2.1 hole 0.6x1.7: 1(-4.32,1.802) 2(4.32,1.802)
  oval 1x1.6 hole 0.6x1.3: 3(4.32,-2.377) 4(-4.32,-2.377)
  rect 0.6x1.15 smd: A1B12(-3.2,2.377) A4B9(-2.4,2.377) B1A12(3.2,2.377) B4A9(2.4,2.377)
  rect 0.3x1.15 smd: A5(-1.25,2.377) A6(-0.25,2.377) A7(0.25,2.377) A8(1.25,2.377) B5(1.75,2.377) B6(0.75,2.377) B7(-0.75,2.377) B8(-1.75,2.377)

## Nets
3V3: BOOT0.2 C3.1 C4.2 C5.1 C6.1 C8.1 C9.2 H1.16 H2.13 P1.3 R6.1 R18.2 R19.2 R28.2 U1.9 U1.24 U1.36 U1.48 U12.5
+5V: F1.1 USB1.A4B9 USB1.B4A9
GND: C1.1 C2.1 C3.2 C4.1 C5.2 C6.2 C7.2 C8.2 C9.1 C10.2 D1.2 H2.15 ModeS.2 NRST.2 P1.1 R26.1 R27.1 R29.2 R30.2 U1.8 U1.23 U1.35 U1.47 U12.2 USB1.1 USB1.2 USB1.3 USB1.4 USB1.A1B12 USB1.B1A12
VCC: C1.2 C2.2 F1.2 P1.2 U12.1 U12.3
BOOT0: BOOT0.1 R26.2 U1.44
BOOT1: H1.15 R27.2 U1.20
CC1: R30.1 USB1.A5
CC2: R29.1 USB1.B5
MCU_D+: U1.43 USB1.A6 USB1.B6
MCU_D-: U1.42 USB1.A7 USB1.B7
MODES: H2.10 ModeS.1 U1.14
NRST: C10.1 NRST.1 R28.1 U1.7
PA0: H2.8 U1.10
PA1: H2.9 U1.11
PA2: R23.1 U1.12
PA3: R22.1 U1.13
PA6: H2.11 U1.16
PA7: H2.12 U1.17
PA8: P1.8 U1.29
PA9: D3.1 H1.8 U1.30
PA10: H1.7 U1.31
PA11: D2.2 H1.6 U1.32
PA12: H1.5 U1.33
PA13: R25.1 U1.34
PA14: R24.1 U1.15 U1.37
PA15: H1.4 U1.38
PB0: H2.14 U1.18
PB1: H2.16 U1.19
PB3: H1.3 U1.39
PB4: H1.2 U1.40
PB5: H1.1 U1.41
PB8: H2.1 U1.45
PB9: H2.2 U1.46
PB10: H1.14 U1.21
PB11: H1.13 U1.22
PB12: H1.12 U1.25
PB13: H1.11 U1.26
PB14: H1.10 U1.27
PB15: H1.9 U1.28
PC13: H2.3 U1.2
PC14: H2.4 U1.3
PC15: H2.5 U1.4
PD0: H2.6 U1.5
PD1: H2.7 U1.6
RX: P1.4 R22.2
SWCLK: P1.7 R24.2
SWDIO: P1.5 R25.2
TX: P1.6 R23.2
$1N1230: D2.1 R18.1
$1N1578: C7.1 U1.1
$1N5862: D1.1 R6.2
$1N8246: D3.2 R19.1

Pads without a net: NOREF N; NOREF#2 N; NOREF#3 N; NOREF#4 N; U12 4; USB1 A8 B8

## Via types
v1: diameter 0.61, hole 0.305, Top Layer to Bottom Layer, 45 vias

## Routing (per net, layer and track width the routed paths; a pad name or vN(x,y) marks a point on that pad's centre or on a via; arc(x,y) is an arc through that point)
3V3: length 157.1
  Top Layer w0.178: U1.48 15.75,17.02 15.43,16.7 C5.1
  Top Layer w0.254: R28.2 2.67,30.35 1.4,29.08 1.4,28.08 BOOT0.2 3.37,28 5.33,26.03 7.62,26.03 v1(8.48,25.17) 9.27,24.38 R19.2 ; 17.25,23.48 17.23,23.49 15.24,23.49 14.67,24.07 C6.1 v1(14.67,25.43) C9.2 ; 17.25,23.48 U1.36 ; 17.25,23.48 17.25,21.48 17.91,20.83 21.36,20.83 ; 30.55,13.91 29.72,14.73 27.56,14.73 25.4,12.57 25.4,10.54 26.16,9.78 29.46,9.78 30.48,8.76 30.48,6.98 29.97,6.48 27.6,6.48 24.8,3.68 9.27,3.68 8.75,4.2 R6.1 8.75,8.75 12.57,12.57 12.57,15.11 12.06,15.62 R18.2 ; 30.55,13.91 U12.5 ; 30.55,13.91 30.99,14.35 33.15,14.35 34.16,13.33 C4.2 35.23,13.22 C3.1 C8.1 ; 21.25,17.1 21.72,17.57 21.72,20.47 21.36,20.83 ; 21.25,17.1 U1.9 ; 21.25,17.1 21.1,17.25 U1.48 ; 21.36,20.83 23.28,22.75 U1.24 25.16,22.75 25.4,22.99 25.4,29.72 25.15,29.97 v1(25.15,30.48)
  Bottom Layer w0.254: v1(35.31,13.21) 36.07,13.97 36.07,19.18 35.31,19.94 33.56,19.94 P1.3 32.32,21.27 33.53,22.48 33.53,30.13 H1.16 27.69,33.57 27.69,31.62 26.54,30.48 v1(25.15,30.48) ; v1(8.48,25.17) 8.74,25.43 v1(14.67,25.43)
+5V: length 12
  Top Layer w0.178: USB1.B4A9 5.93,17.6 5.7,17.82 5.42,17.82 4.93,18.31 4.93,21.69 5.46,22.22 6,22.22 USB1.A4B9
  Top Layer w0.254: USB1.B4A9 6.91,17.6 8.76,15.75 F1.1
GND: length 46
  Top Layer w0.178: C7.2 14.16,14.8 13.97,14.99 13.97,15.81 C5.2 v1(14.03,16.83) 14.96,17.75 U1.47
  Top Layer w0.254: C9.1 v1(16.07,25.41) ; v1(16.07,25.41) C6.2 ; v1(16.07,25.41) 17.53,25.41 17.75,25.18 U1.35 ; ModeS.2 v1(4.19,12) ; C3.2 v1(36.07,9.78) ; v1(22.61,20.7) 22.61,21.48 23.37,22.25 U1.23 ; NRST.2 v1(2.54,32) ; R30.2 11.29,22.22 v1(11.05,21.97) ; C1.1 v1(26.03,12.26) ; USB1.1 6.18,23.74 USB1.A1B12 7.32,23.2 v1(7.87,23.75) ; R26.1 v1(10.03,28.07) ; v1(7.24,14.35) 7.62,14.73 7.62,16.13 6.95,16.8 USB1.B1A12 6.18,16.25 USB1.2 ; v1(28.83,14.1) C2.1 ; 34.18,11.18 v1(34.18,9.78) ; C10.2 v1(8.83,33.15) ; v1(21.08,14.1) 20.75,14.43 U1.8 ; D1.2 v1(1.78,8) ; R27.1 v1(28.58,23.37) ; C8.2 v1(37.85,9.78)
  Top Layer w0.508: C1.1 27.63,12.97 C2.1 29.73,12.06 31.24,12.06 31.5,11.81 U12.2 ; C4.1 34.18,11.18 35.05,11.18 35.24,10.98 C3.2 C8.2
  vias: v1(11.29,17.14)
VCC: length 68
  Top Layer w0.254: U12.3 v1(32.45,11.94)
  Top Layer w0.508: 31.32,8.81 31.32,3.76 30.35,2.79 8.13,2.79 5.97,4.95 5.97,8.51 F1.2 ; 31.32,8.81 30.55,9.59 U12.1 28.83,10.91 28.78,10.86 C1.2 ; 31.32,8.81 32.45,9.94 U12.3
  Bottom Layer w0.254: 34.77,23.81 36.7,21.88 36.7,13.72 34.92,11.94 v1(32.45,11.94)
BOOT0: length 18
  Top Layer w0.178: v1(12.83,21.59) 12.52,21.9 12.52,25.71 11.94,26.29 8.64,26.29 7.37,27.55 R26.2 5.75,28.07 BOOT0.1 ; U1.44 v1(13.97,19.25)
  Bottom Layer w0.178: v1(13.97,19.25) 13.97,20.32 14.35,20.7 14.35,21.21 13.97,21.59 v1(12.83,21.59)
BOOT1: length 18.6
  Top Layer w0.178: 26.44,22.12 27.23,21.34 29.72,21.34 30.09,21.71 R27.2 ; 26.44,22.12 26.44,29.78 28.89,32.23 ; 26.44,22.12 25.07,20.75 U1.20
CC1: length 4.3
  Top Layer w0.178: USB1.A5 7.41,21.25 9.02,22.86 R30.1
CC2: length 4.1
  Top Layer w0.178: R29.1 8.68,18.25 USB1.B5
MCU_D+: length 11.6
  Top Layer w0.178: USB1.B6 7.06,19.25 7.75,19.94 ; U1.43 14.92,19.75 14.73,19.94 7.75,19.94 ; USB1.A6 7.44,20.25 7.75,19.94
MCU_D-: length 12.5
  Top Layer w0.178: U1.42 7.94,20.25 7.44,20.75 USB1.B7 5.44,20.75 5.21,20.52 5.21,19.93 5.38,19.75 USB1.A7
MODES: length 33.8
  Top Layer w0.178: 21.67,8.2 22.1,8.64 22.1,11.81 25.4,15.11 25.4,17.53 25.18,17.75 U1.14
  Top Layer w0.254: ModeS.1 2.9,10.41 v1(6.6,10.41)
  Bottom Layer w0.254: H2.10 18.63,10.41 v1(6.6,10.41)
NRST: length 40.2
  Top Layer w0.178: NRST.1 7.42,32 ; 7.42,32 C10.1 ; 7.42,32 7.49,31.93 7.49,31.5 7.75,31.24 8.38,31.24 8.88,30.74 R28.1 12.8,26.43 12.8,22.57 13.72,21.65 v1(13.72,20.95) ; U1.7 v1(20.25,13.33)
  Bottom Layer w0.178: v1(13.72,20.95) 10.35,20.95 9.68,21.63 9.04,21.63 8.64,21.22 8.64,18.54 13.84,13.33 v1(20.25,13.33)
PA0: length 9.2
  Top Layer w0.178: H2.8 19.66,8.7 19.66,11.42 21.75,13.51 U1.10
PA1: length 12
  Top Layer w0.178: 21.27,5.23 19.94,6.56 19.94,11.3 22.25,13.61 U1.11
PA2: length 6.3
  Top Layer w0.178: U1.12 v1(23.49,15.75) ; R23.1 v1(27.69,15.62)
  Bottom Layer w0.178: v1(23.49,15.75) 24.39,15.75 24.87,16.23 26.31,16.23 26.92,15.62 v1(27.69,15.62)
PA3: length 6.8
  Top Layer w0.178: U1.13 24.26,17.24 v1(24.26,16.51) ; v1(27.43,20.07) R22.1
  Bottom Layer w0.178: v1(27.43,20.07) 24.26,16.89 v1(24.26,16.51)
PA6: length 16.5
  Top Layer w0.178: U1.16 25.19,18.75 25.68,18.26 25.68,14.88 22.48,11.68 22.48,6.56 23.81,5.23
PA7: length 14.4
  Top Layer w0.178: H2.12 22.86,8.72 22.86,11.56 25.96,14.66 25.96,18.49 25.2,19.25 U1.17
PA8: length 18.6
  Top Layer w0.178: U1.29 v1(20.75,22.1)
  Bottom Layer w0.178: P1.8 33.56,17.4 31.75,17.4 27.05,22.1 v1(20.75,22.1)
PA9: length 27.6
  Top Layer w0.178: H1.8 20.07,33.43 20.07,25.27 20.25,25.09 U1.30 20.25,22.41 v1(19.81,21.97) ; 10.2,21.08 v1(9.27,21.08)
  Bottom Layer w0.178: v1(9.27,21.08) 11.68,18.67 15.36,18.67 18.8,22.11 19.67,22.11 v1(19.81,21.97)
PA10: length 8.4
  Top Layer w0.178: 18.73,32.23 18.73,30.93 19.75,29.91 U1.31
PA11: length 27
  Top Layer w0.178: v1(18.92,21.46) 19.25,21.79 U1.32 19.25,25.09 19.47,25.31 19.47,29.68 17.4,31.75 17.4,33.56 H1.6 ; D2.2 v1(9.27,18.92)
  Bottom Layer w0.178: v1(9.27,18.92) 9.91,18.29 15.75,18.29 v1(18.92,21.46)
PA12: length 9.5
  Top Layer w0.178: 16.19,32.23 16.41,32.23 19.19,29.45 19.19,25.54 18.75,25.1 U1.33
PA13: length 12.4
  Top Layer w0.178: R25.1 v1(27.56,24.51) ; U1.34 v1(18.25,25.78)
  Bottom Layer w0.178: v1(18.25,25.78) 26.29,25.78 v1(27.56,24.51)
PA14: length 18.5
  Top Layer w0.178: R24.1 26.36,20.07 v1(26.29,20.07) ; v1(22.86,18.25) U1.15 ; U1.37 16.75,22.75 16.89,22.61 16.89,21.34 19.98,18.25 v1(20.83,18.25)
  Bottom Layer w0.178: v1(22.86,18.25) 24.47,18.25 v1(26.29,20.07)
  Bottom Layer w0.254: v1(22.86,18.25) v1(20.83,18.25)
PA15: length 14.8
  Top Layer w0.178: U1.38 14.83,22.25 13.92,23.16 13.92,30.3 14.99,31.37 14.99,33.43 H1.4
PB0: length 14.7
  Top Layer w0.178: U1.18 25.21,19.75 26.29,18.67 26.29,14.48 24.64,12.83 24.64,9.52 26.35,7.81
PB1: length 17.1
  Top Layer w0.178: U1.19 25.22,20.25 26.57,18.9 26.57,14.25 25.02,12.7 25.02,10.16 25.78,9.4 27.3,9.4 28.89,7.81 H2.16
PB3: length 11.9
  Top Layer w0.178: 13.65,32.23 13.64,32.22 13.64,22.94 14.83,21.75 U1.39
PB4: length 15.9
  Top Layer w0.178: H1.2 12.45,33.43 12.45,31.11 13.36,30.2 13.36,22.8 14.91,21.25 U1.40
PB5: length 13.8
  Top Layer w0.178: U1.41 15.02,20.75 13.08,22.68 13.08,30.01 11.11,31.98 11.11,32.23
PB8: length 17.3
  Top Layer w0.178: 11.11,5.23 9.91,6.43 9.91,9.27 12.95,12.32 12.95,17.4 14.3,18.75 U1.45
PB9: length 13.2
  Top Layer w0.178: H2.2 11.11,9.71 13.33,11.94 13.33,17.14 14.44,18.25 U1.46
PB10: length 16
  Top Layer w0.178: U1.21 25.06,21.25 26.16,22.35 26.16,30.1 27.69,31.62 27.69,33.43 H1.14
PB11: length 11.8
  Top Layer w0.178: U1.22 25.05,21.75 25.88,22.58 25.88,30.28 26.35,30.75 26.35,32.23
PB12: length 12.8
  Top Layer w0.178: U1.25 22.75,25 22.53,25.22 22.53,29.97 23.51,30.95 24.47,30.95 25.15,31.62 25.15,33.43 H1.12
PB13: length 8.6
  Top Layer w0.178: U1.26 22.25,30.67 23.81,32.23
PB14: length 11.3
  Top Layer w0.178: U1.27 21.75,25.05 21.97,25.27 21.97,30.99 22.48,31.5 22.48,33.56 H1.10
PB15: length 8.3
  Top Layer w0.178: 21.27,32.23 21.69,31.81 21.69,25.5 21.25,25.06 U1.28
PC13: length 13.6
  Top Layer w0.178: 13.65,5.23 12.45,6.43 12.45,8.33 13.12,9 13.83,9 14.43,9.6 14.43,11.25 17.75,14.57 U1.2
PC14: length 9.9
  Top Layer w0.178: U1.3 18.25,14.57 14.71,11.02 14.71,8.83 H2.4
PC15: length 12.6
  Top Layer w0.178: U1.4 18.75,14.56 14.99,10.8 14.99,6.43 16.19,5.23
PD0: length 9.2
  Top Layer w0.178: H2.6 17.12,8.7 17.12,12.42 19.25,14.55 U1.5
PD1: length 12
  Top Layer w0.178: U1.6 19.75,14.66 17.4,12.3 17.4,6.56 18.73,5.23
RX: length 9.2
  Top Layer w0.178: P1.4 33.4,19.9 33.4,18.03 32.89,17.53 31.5,17.53 30.86,18.16 30.86,19.56 30.35,20.07 R22.2
SWCLK: length 2.8
  Top Layer w0.178: R24.2 31.74,16.19 P1.7
SWDIO: length 6.7
  Top Layer w0.178: R25.2 30.99,23.61 30.99,19.97 32.23,18.73
TX: length 7.6
  Top Layer w0.178: 34.77,18.73 33.53,17.49 33.53,15.62 32.89,14.99 30.73,14.99 R23.2
$1N1230: length 5.9
  Top Layer w0.178: R18.1 9.79,16.14 10.03,16.38 12.27,16.38 12.45,16.56 12.45,18.38 D2.1
$1N1578: length 3.1
  Top Layer w0.178: U1.1 17.25,14.58 16.76,14.1 15.56,14.1
$1N5862: length 5.2
  Top Layer w0.254: R6.2 7.24,7.99 v1(7.24,6.86) ; D1.1 v1(4.35,6.86)
  Bottom Layer w0.254: v1(7.24,6.86) v1(4.35,6.86)
$1N8246: length 4.1
  Top Layer w0.178: R19.1 11.94,24.38 12.18,24.14 12.18,22.09 11.81,21.72 11.81,21.3 11.9,21.21

## Copper pours and planes (outline as drawn; the poured copper is in the pictures)
GND on Top Layer: -0.21,40 39.75,40 39.75,0 -0.21,0
GND on Bottom Layer: -0.21,40 39.75,40 39.75,0 -0.21,0

## Text on the board
Bottom Silkscreen Layer: B9 | B4 | B8 | B5 | C14 | A15 | B3 | C13 | D0 | A11 | C15 | A12 | A0 | A9 | D1 | A10 | A4 | B14 | A1 | B15 | A7 | B12 | A6 | B13 | B0 | B10 | B11 | 3V3 | B1 | BT1 | GND | LED | NRST | BOOT0 | ModeS | CLK | DIO | Rx | Tx | 5V | RST | 剑圣 | >>开局抓上路 问就是套路
Top Silkscreen Layer: V2.1 | GND 5V | 3V3 Rx | DIO Tx | CLK RT | RYMCU x WCH-DAPLink | RY-CH32V203
